# Altium schematic sheet eth_10base-t1s_phy.SchDoc
size B
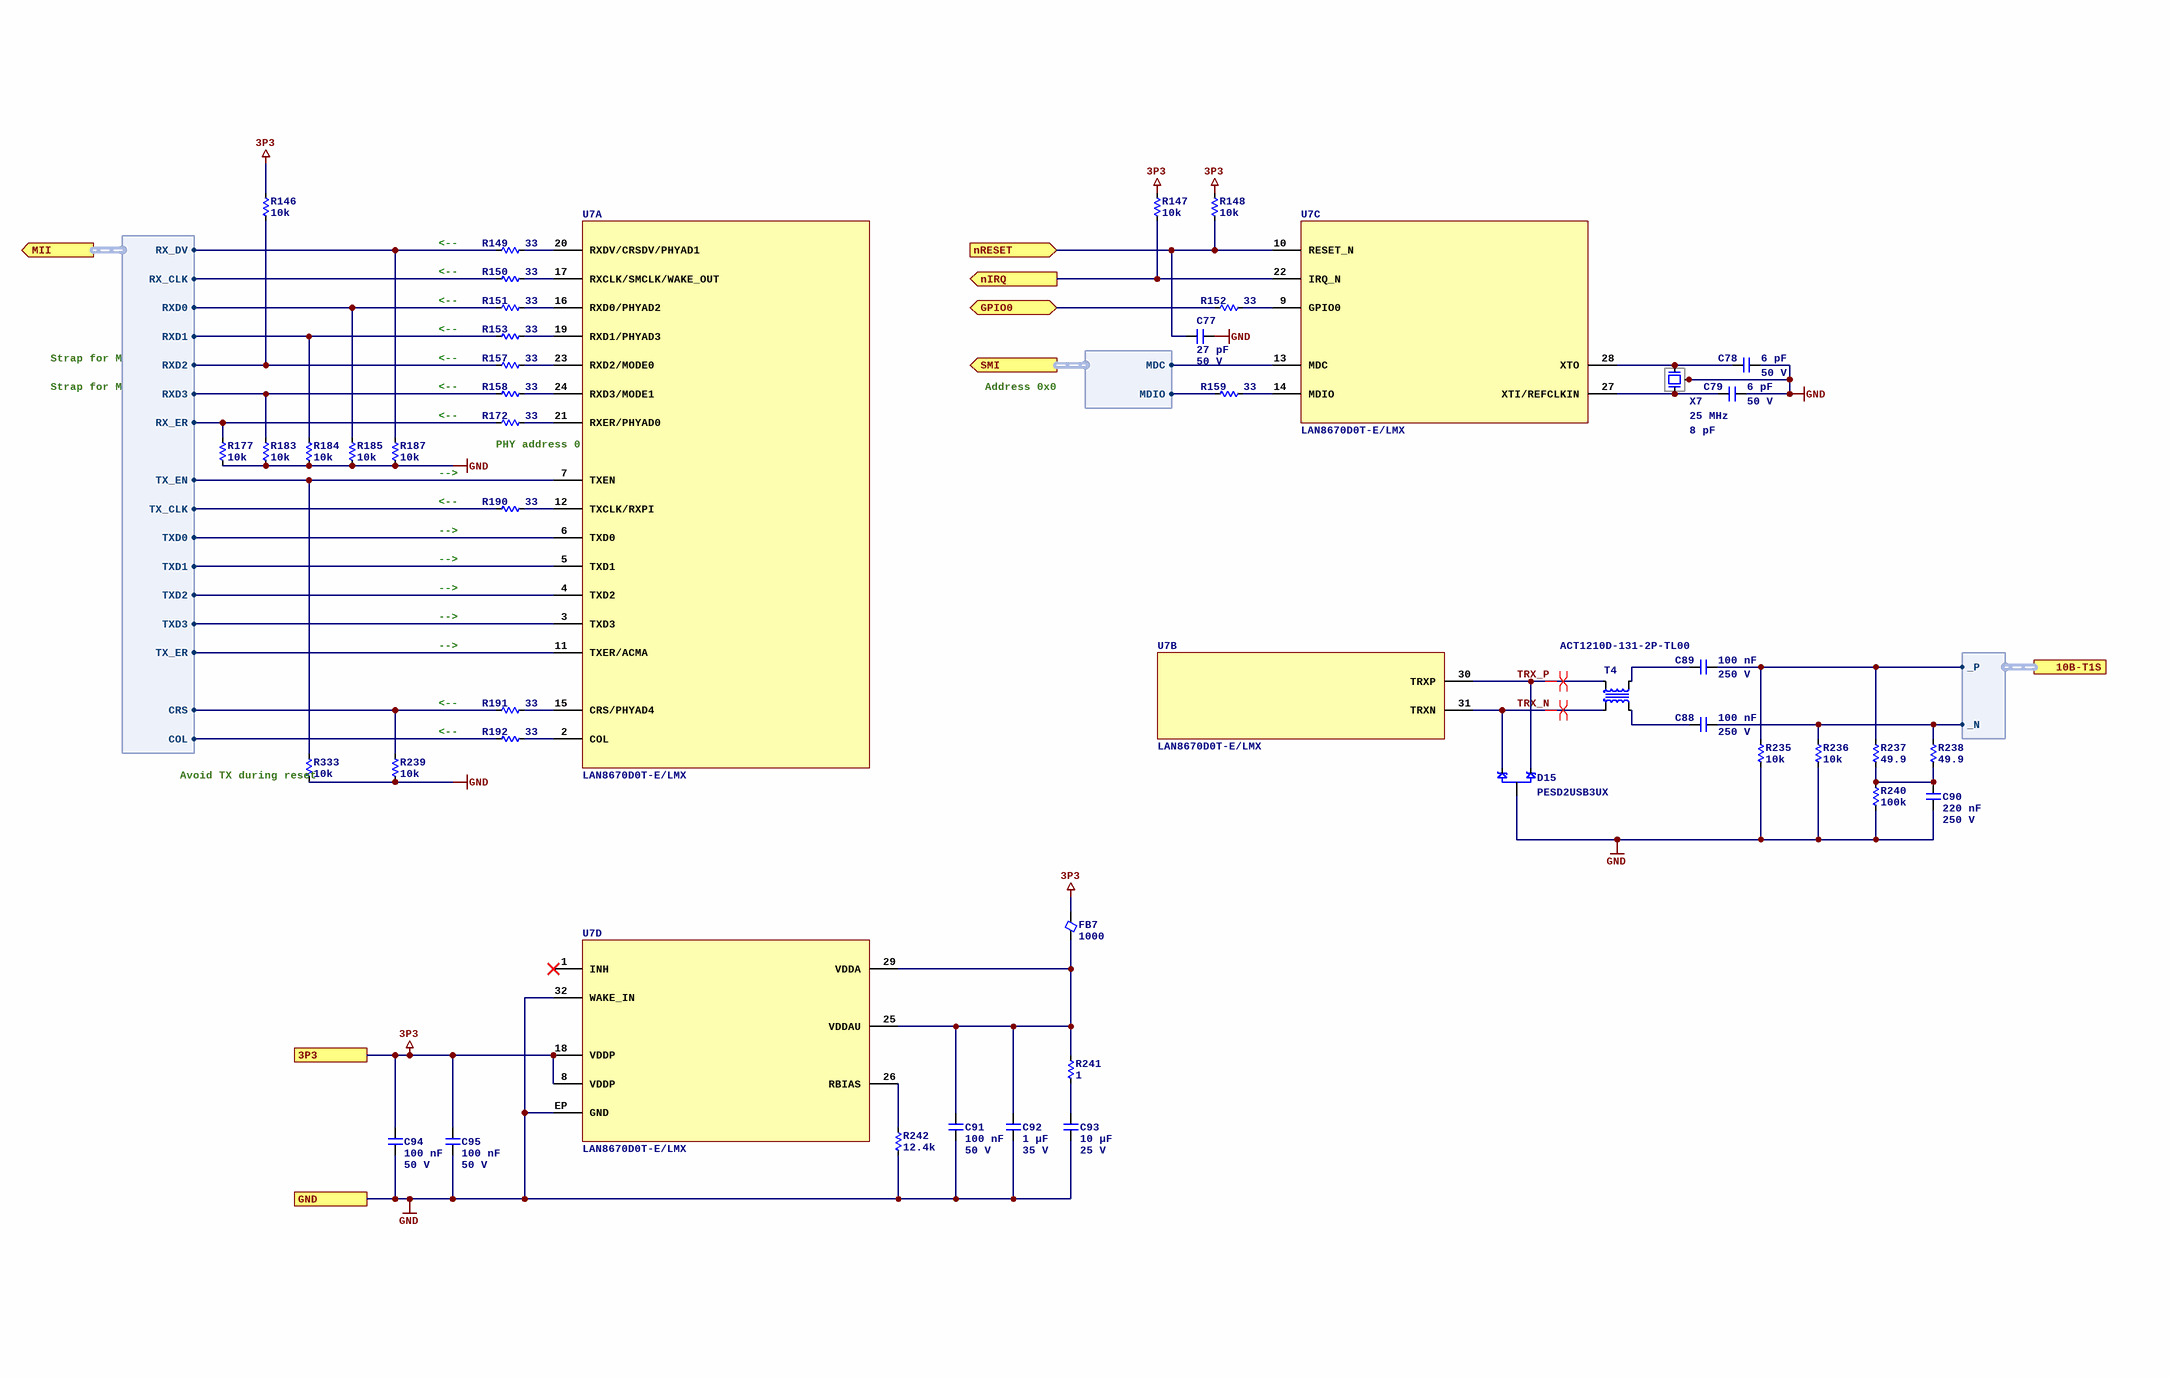
[diagram p0: eth_10base-t1s_phy.SchDoc]

## Parts
C77  Capacitance: 27 pF  Voltage Rating: 50 V  [C0402]  (hidden comment: 0402CG270J500NT)
C78  Capacitance: 6 pF  Voltage Rating: 50 V  [C0402]  (hidden comment: 0402CG6R0C500NT)
C79  Capacitance: 6 pF  Voltage Rating: 50 V  [C0402]  (hidden comment: 0402CG6R0C500NT)
C88  Capacitance: 100 nF  Voltage Rating: 250 V  [C1206]  (hidden comment: FM31X104K251EEG)
C89  Capacitance: 100 nF  Voltage Rating: 250 V  [C1206]  (hidden comment: FM31X104K251EEG)
C90  Capacitance: 220 nF  Voltage Rating: 250 V  [C1210]  (hidden comment: FM32X224K251EEG)
C91  Capacitance: 100 nF  Voltage Rating: 50 V  [C0402]  (hidden comment: CL05B104KB54PNC)
C92  Capacitance: 1 µF  Voltage Rating: 35 V  [C0603]  (hidden comment: GMK107AB7105KAHT)
C93  Capacitance: 10 µF  Voltage Rating: 25 V  [C0805]  (hidden comment: CL21B106KAYQNNE)
C94  Capacitance: 100 nF  Voltage Rating: 50 V  [C0402]  (hidden comment: CL05B104KB54PNC)
C95  Capacitance: 100 nF  Voltage Rating: 50 V  [C0402]  (hidden comment: CL05B104KB54PNC)
D15  PESD2USB3UX  [3SOT23]
FB7  Current Rating (mA): 1000  [FB0805]  (hidden comment: HCB2012KF-102T10)
R146  value 10k  [R0402]  (hidden comment: 0402WGF1002TCE)
R147  value 10k  [R0402]  (hidden comment: 0402WGF1002TCE)
R148  value 10k  [R0402]  (hidden comment: 0402WGF1002TCE)
R149  value 33  [R0402]  (hidden comment: 0402WGF330JTCE)
R150  value 33  [R0402]  (hidden comment: 0402WGF330JTCE)
R151  value 33  [R0402]  (hidden comment: 0402WGF330JTCE)
R152  value 33  [R0402]  (hidden comment: 0402WGF330JTCE)
R153  value 33  [R0402]  (hidden comment: 0402WGF330JTCE)
R157  value 33  [R0402]  (hidden comment: 0402WGF330JTCE)
R158  value 33  [R0402]  (hidden comment: 0402WGF330JTCE)
R159  value 33  [R0402]  (hidden comment: 0402WGF330JTCE)
R172  value 33  [R0402]  (hidden comment: 0402WGF330JTCE)
R177  value 10k  [R0402]  (hidden comment: 0402WGF1002TCE)
R183  value 10k  [R0402]  (hidden comment: 0402WGF1002TCE)
R184  value 10k  [R0402]  (hidden comment: 0402WGF1002TCE)
R185  value 10k  [R0402]  (hidden comment: 0402WGF1002TCE)
R187  value 10k  [R0402]  (hidden comment: 0402WGF1002TCE)
R190  value 33  [R0402]  (hidden comment: 0402WGF330JTCE)
R191  value 33  [R0402]  (hidden comment: 0402WGF330JTCE)
R192  value 33  [R0402]  (hidden comment: 0402WGF330JTCE)
R235  value 10k  [R1206]  (hidden comment: 1206W4F1002T5E)
R236  value 10k  [R1206]  (hidden comment: 1206W4F1002T5E)
R237  value 49.9  [R1206]  (hidden comment: FRC1206F49R9TS)
R238  value 49.9  [R1206]  (hidden comment: FRC1206F49R9TS)
R239  value 10k  [R0402]  (hidden comment: 0402WGF1002TCE)
R240  value 100k  [R1206]  (hidden comment: 1206W4F1003T5E)
R241  value 1  [R0402]  (hidden comment: CRCW04021R00FKED)
R242  value 12.4k  [R0402]  (hidden comment: 0402WGD1242TCE)
R333  value 10k  [R0402]  (hidden comment: 0402WGF1002TCE)
T4  ACT1210D-131-2P-TL00  [CHOKE_ACT1210D-131-2P-TL00]
U7  LAN8670D0T-E/LMX  [QFN50P500X500X90-32N]  (parts A,B,C,D of 4)
X7  Frequency: 25 MHz  Capacitance: 8 pF  [4_SMD_2.0X1.6MM]  (hidden comment: ABM11W-25.0000MHZ-8-D1X-T3)

## Ports
3P3, 10B-T1S (harness DIFF), GND, GPIO0 (bidir), MII (out, harness MII), nIRQ (out), nRESET (in), SMI (out, harness SMI)

## Harnesses
MII: RXD0, RXD1, TX_EN, TXD0, TXD1, RXD2, RXD3, TXD2, TXD3, TX_ER, TX_CLK, CRS, COL, RX_ER, RX_DV, RX_CLK
SMI: MDC, MDIO
DIFF: _N, _P

## Nets
3P3: C94.1 C95.1 FB7.2 R146.1 R147.1 R148.1 U7.8(VDDP) U7.18(VDDP) ; port 3P3
GND: C77.2 C78.2 C79.2 C90.2 C91.2 C92.2 C93.2 C94.2 C95.2 D15.3 R177.2 R183.2 R184.2 R185.2 R187.2 R235.2 R236.2 R239.2 R240.2 R242.2 R333.2 U7.32(WAKE_IN) U7.EP(GND) X7.2 X7.4 ; port GND
GPIO0: R152.2 ; port GPIO0
nIRQ: R147.2 U7.22(IRQ_N) ; port nIRQ
nRESET: C77.1 R148.2 U7.10(RESET_N) ; port nRESET
TRX_N: D15.1 T4.1 U7.31(TRXN)
TRX_P: D15.2 T4.2 U7.30(TRXP)
NetC78_1: C78.1 U7.28(XTO) X7.3
NetC79_1: C79.1 U7.27(XTI/REFCLKIN) X7.1
NetC88_1: C88.1 T4.4
NetC88_2: C88.2 R236.1 R238.1 ; port 10B-T1S._N
NetC89_1: C89.1 T4.3
NetC89_2: C89.2 R235.1 R237.1 ; port 10B-T1S._P
NetC90_1: C90.1 R237.2 R238.2 R240.1
NetC91_1: C91.1 C92.1 FB7.1 R241.2 U7.25(VDDAU) U7.29(VDDA)
NetC93_1: C93.1 R241.1
NetR146_2: R146.2 R157.2 ; port MII.RXD2
NetR149_1: R149.1 U7.20(RXDV/CRSDV/PHYAD1)
NetR149_2: R149.2 R187.1 ; port MII.RX_DV
NetR150_1: R150.1 U7.17(RXCLK/SMCLK/WAKE_OUT)
NetR150_2: R150.2 ; port MII.RX_CLK
NetR151_1: R151.1 U7.16(RXD0/PHYAD2)
NetR151_2: R151.2 R185.1 ; port MII.RXD0
NetR152_1: R152.1 U7.9(GPIO0)
NetR153_1: R153.1 U7.19(RXD1/PHYAD3)
NetR153_2: R153.2 R184.1 ; port MII.RXD1
NetR157_1: R157.1 U7.23(RXD2/MODE0)
NetR158_1: R158.1 U7.24(RXD3/MODE1)
NetR158_2: R158.2 R183.1 ; port MII.RXD3
NetR159_1: R159.1 U7.14(MDIO)
NetR159_2: R159.2 ; port SMI.MDIO
NetR172_1: R172.1 U7.21(RXER/PHYAD0)
NetR172_2: R172.2 R177.1 ; port MII.RX_ER
NetR190_1: R190.1 U7.12(TXCLK/RXPI)
NetR190_2: R190.2 ; port MII.TX_CLK
NetR191_1: R191.1 U7.15(CRS/PHYAD4)
NetR191_2: R191.2 R239.1 ; port MII.CRS
NetR192_1: R192.1 U7.2(COL)
NetR192_2: R192.2 ; port MII.COL
NetR242_1: R242.1 U7.26(RBIAS)
NetR333_1: R333.1 U7.7(TXEN) ; port MII.TX_EN
NetU7_3: U7.3(TXD3) ; port MII.TXD3
NetU7_4: U7.4(TXD2) ; port MII.TXD2
NetU7_5: U7.5(TXD1) ; port MII.TXD1
NetU7_6: U7.6(TXD0) ; port MII.TXD0
NetU7_11: U7.11(TXER/ACMA) ; port MII.TX_ER
NetU7_13: U7.13(MDC) ; port SMI.MDC

Not connected (* = marked no-connect by the designer): U7 1(INH)*

## Layout directives
differential pair; differential pair class DE_100: TRX_N, TRX_P

## Notes on the sheet
- <--
- Strap for MII
- Address 0x0
- (near R187) <--
- PHY address 0
- -->
- (near R187) -->
- (near R239) <--
- (near R333) Avoid TX during reset

## Library data of the parts
C77 = 0402CG270J500NT: Manufacturer: FH(Guangdong Fenghua Advanced Tech); Dielectric: C0G; ComponentLink1URL: https://wmsc.lcsc.com/wmsc/upload/file/pdf/v2/lcsc/2304140030_FH--Guangdong-Fenghua-Advanced-Tech-0402CG270J500NT_C1557.pdf; ComponentLink1Description: Datasheet; Manufacturer Part Number: 0402CG270J500NT; Package: 0402; Supplier 2: LCSC; Supplier Part Number 2: C1557
C78 C79 = 0402CG6R0C500NT: Manufacturer: FH(Guangdong Fenghua Advanced Tech); Dielectric: C0G; ComponentLink1URL: https://wmsc.lcsc.com/wmsc/upload/file/pdf/v2/lcsc/2304140030_FH--Guangdong-Fenghua-Advanced-Tech-0402CG6R0C500NT_C1575.pdf; ComponentLink1Description: Datasheet; Manufacturer Part Number: 0402CG6R0C500NT; Package: 0402; Supplier 2: LCSC; Supplier Part Number 2: C1575
C88 C89 = FM31X104K251EEG: Manufacturer: PSA(Prosperity Dielectrics); Dielectric: X7R; ComponentLink1URL: https://wmsc.lcsc.com/wmsc/upload/file/pdf/v2/lcsc/2409271633_PSA-Prosperity-Dielectrics-FM31X104K251EEG_C365814.pdf; ComponentLink1Description: Datasheet; Manufacturer Part Number: FM31X104K251EEG; Package: 1206; Supplier 2: LCSC; Supplier Part Number 2: C365814
C90 = FM32X224K251EEG: Manufacturer: PSA(Prosperity Dielectrics); Dielectric: X7R; ComponentLink1URL: https://wmsc.lcsc.com/wmsc/upload/file/pdf/v2/lcsc/2304140030_PSA-Prosperity-Dielectrics-FM32X224K251EEG_C146177.pdf; ComponentLink1Description: Datasheet; Manufacturer Part Number: FM32X224K251EEG; Package: 1210; Supplier 2: LCSC; Supplier Part Number 2: C146177
C91 C94 C95 = CL05B104KB54PNC: Manufacturer: Samsung Electro-Mechanics; Dielectric: X7R; ComponentLink1URL: https://wmsc.lcsc.com/wmsc/upload/file/pdf/v2/lcsc/2304140030_Samsung-Electro-Mechanics-CL05B104KB54PNC_C307331.pdf; ComponentLink1Description: Datasheet; Manufacturer Part Number: CL05B104KB54PNC; Package: 0402; Supplier 2: LCSC; Supplier Part Number 2: C307331
C92 = GMK107AB7105KAHT: Manufacturer: Taiyo Yuden; Dielectric: X7R; ComponentLink1URL: https://datasheet.lcsc.com/lcsc/2304140030_Taiyo-Yuden-GMK107AB7105KAHT_C841050.pdf; ComponentLink1Description: Datasheet; Manufacturer Part Number: GMK107AB7105KAHT; Package: 0603; Supplier 2: LCSC; Supplier Part Number 2: C841050
C93 = CL21B106KAYQNNE: Manufacturer: Samsung Electro-Mechanics; Dielectric: X7R; ComponentLink1URL: https://datasheet.lcsc.com/lcsc/2206222030_Samsung-Electro-Mechanics-CL21B106KAYQNNE_C3039694.pdf; ComponentLink1Description: Datasheet; Manufacturer Part Number: CL21B106KAYQNNE; Package: 0805; Supplier 2: LCSC; Supplier Part Number 2: C3039694
D15 = PESD2USB3UX: DIODE ESD USB SOT-23; Manufacturer: Nexperia USA Inc.; Polarity: Unidirectional; Capacitance (pF): 0.7; Standoff (V): 3.3; Min Breakdown Voltage: 4.2 V; Supplier 1: DigiKey; Supplier Part Number 1: 1727-PESD2USB3UX-CT-ND; Manufacturer Part Number: PESD2USB3UX; Supplier 2: LCSC; Supplier Part Number 2: C3708426; ComponentLink1Description: Datasheet; ComponentLink1URL: https://assets.nexperia.com/documents/data-sheet/PESD2USB3UX-T.pdf; Supplier 3: Mouser; Supplier Part Number 3: 771-PESD2USB3UX-TR
FB7 = HCB2012KF-102T10: Manufacturer: TAI-TECH; DCR (mOhms): 200; ComponentLink1URL: https://wmsc.lcsc.com/wmsc/upload/file/pdf/v2/lcsc/2009171138_TAI-TECH-HCB2012KF-102T10_C356985.pdf; ComponentLink1Description: Datasheet; Manufacturer Part Number: HCB2012KF-102T10; Supplier 2: LCSC; Supplier Part Number 2: C356985; Package: 0805; Z @ 100 MHz: 1000
R146-R148 R177 R183-R185 R187 R239 R333 = 0402WGF1002TCE: Manufacturer: UNI-ROYAL(Uniroyal Elec); Tolerance: 1%; Temperature Coefficient: ±100ppm/?; Power Rating (mW): 62.5; ComponentLink1Description: Datasheet; ComponentLink1URL: https://wmsc.lcsc.com/wmsc/upload/file/pdf/v2/lcsc/2206010100_UNI-ROYAL-Uniroyal-Elec-0402WGF1002TCE_C25744.pdf; Manufacturer Part Number: 0402WGF1002TCE; Package: 0402; Supplier 2: LCSC; Supplier Part Number 2: C25744
R149-R153 R157-R159 R172 R190-R192 = 0402WGF330JTCE: Manufacturer: UNI-ROYAL(Uniroyal Elec); Tolerance: 1%; Temperature Coefficient: ±100ppm/?; Power Rating (mW): 62.5; ComponentLink1Description: Datasheet; ComponentLink1URL: https://wmsc.lcsc.com/wmsc/upload/file/pdf/v2/lcsc/2205311900_UNI-ROYAL-Uniroyal-Elec-0402WGF330JTCE_C25105.pdf; Manufacturer Part Number: 0402WGF330JTCE; Package: 0402; Supplier 2: LCSC; Supplier Part Number 2: C25105
R235 R236 = 1206W4F1002T5E: Manufacturer: UNI-ROYAL(Uniroyal Elec); Tolerance: 1%; Temperature Coefficient: ±100ppm/?; Power Rating (mW): 250; ComponentLink1Description: Datasheet; ComponentLink1URL: https://wmsc.lcsc.com/wmsc/upload/file/pdf/v2/lcsc/2206010145_UNI-ROYAL-Uniroyal-Elec-1206W4F1002T5E_C17902.pdf; Manufacturer Part Number: 1206W4F1002T5E; Package: 1206; Supplier 2: LCSC; Supplier Part Number 2: C17902
R237 R238 = FRC1206F49R9TS: Manufacturer: FOJAN; Tolerance: 1%; Temperature Coefficient: ±100ppm/?; Power Rating (mW): 250; ComponentLink1Description: Datasheet; ComponentLink1URL: https://datasheet.lcsc.com/lcsc/2308241947_FOJAN-FRC1206F49R9TS_C2907389.pdf; Manufacturer Part Number: FRC1206F49R9TS; Package: 1206; Supplier 2: LCSC; Supplier Part Number 2: C2907389
R240 = 1206W4F1003T5E: Manufacturer: UNI-ROYAL(Uniroyal Elec); Tolerance: 1%; Temperature Coefficient: ±100ppm/?; Power Rating (mW): 250; ComponentLink1Description: Datasheet; ComponentLink1URL: https://wmsc.lcsc.com/wmsc/upload/file/pdf/v2/lcsc/2206010145_UNI-ROYAL-Uniroyal-Elec-1206W4F1003T5E_C17900.pdf; Manufacturer Part Number: 1206W4F1003T5E; Package: 1206; Supplier 2: LCSC; Supplier Part Number 2: C17900
R241 = CRCW04021R00FKED: Manufacturer: Vishay Intertech; Tolerance: 1%; Temperature Coefficient: ±100ppm/?; Power Rating (mW): 63; ComponentLink1Description: Datasheet; ComponentLink1URL: https://wmsc.lcsc.com/wmsc/upload/file/pdf/v2/lcsc/2211030200_Vishay-Intertech-CRCW04021R00FKED_C482087.pdf; Manufacturer Part Number: CRCW04021R00FKED; Package: 0402; Supplier 2: LCSC; Supplier Part Number 2: C482087
R242 = 0402WGD1242TCE: Manufacturer: UNI-ROYAL(Uniroyal Elec); Tolerance: 0.5%; Temperature Coefficient: ±100ppm/?; Power Rating (mW): 62.5; ComponentLink1Description: Datasheet; ComponentLink1URL: https://wmsc.lcsc.com/wmsc/upload/file/pdf/v2/lcsc/2411221127_UNI-ROYAL-Uniroyal-Elec-0402WGD1242TCE_C407750.pdf; Manufacturer Part Number: 0402WGD1242TCE; Package: 0402; Supplier 2: LCSC; Supplier Part Number 2: C407750
T4 = ACT1210D-131-2P-TL00: 130 µH @ 100 kHz 2 Line Common Mode Choke Surface Mount 6.7 kOhms @ 10 MHz 115mA DCR 3.5Ohm; Manufacturer: TDK Corporation; Supplier 1: DigiKey; ComponentLink1URL: https://product.tdk.com/system/files/dam/doc/product/emc/emc/cmf_cmc/catalog/cmf_automotive_signal_act1210d_en.pdf; ComponentLink1Description: Datasheet; Supplier Part Number 1: 445-ACT1210D-131-2P-TL00CT-ND; Manufacturer Part Number: ACT1210D-131-2P-TL00; Supplier 2: LCSC; Supplier Part Number 2: C5547342; Supplier 3: Mouser; Supplier Part Number 3: 810-ACT1210D1312PTL0
U7 = LAN8670D0T-E/LMX: 10BASE-T1S PHY WITH MII/RMII "1/1 Transceiver Full, Half Ethernet 32-VQFN (5x5)"; Manufacturer: Microchip; Supplier 1: DigiKey; Supplier Part Number 1: 150-LAN8670D0T-E/LMXTR-ND; Manufacturer Part Number: LAN8670D0T-E/LMX; ComponentLink1Description: Datasheet; ComponentLink1URL: https://ww1.microchip.com/downloads/aemDocuments/documents/AIS/ProductDocuments/DataSheets/LAN8670-1-2-Data-Sheet-60001573.pdf; Supplier 3: Microchip Direct; Supplier Part Number 3: LAN8670D0T-E/LMX
X7 = ABM11W-25.0000MHZ-8-D1X-T3: 25 MHz ±10ppm Crystal 8pF 50 Ohms 4-SMD, No Lead; Manufacturer: Abracon LLC; Supplier 1: DigiKey; Supplier Part Number 1: 535-13853-1-ND; Manufacturer Part Number: ABM11W-25.0000MHZ-8-D1X-T3; Supplier 2: LCSC; Supplier Part Number 2: C1985767; ComponentLink1Description: Datasheet; ComponentLink1URL: https://abracon.com/Resonators/ABM11W.pdf; Supplier 3: Mouser; Supplier Part Number 3: 815-11W25-8D1XT